# Altium schematic sheet THS7002CPWP_Schematic.SchDoc
size A; SheetNumber: 12; SheetTotal: 15
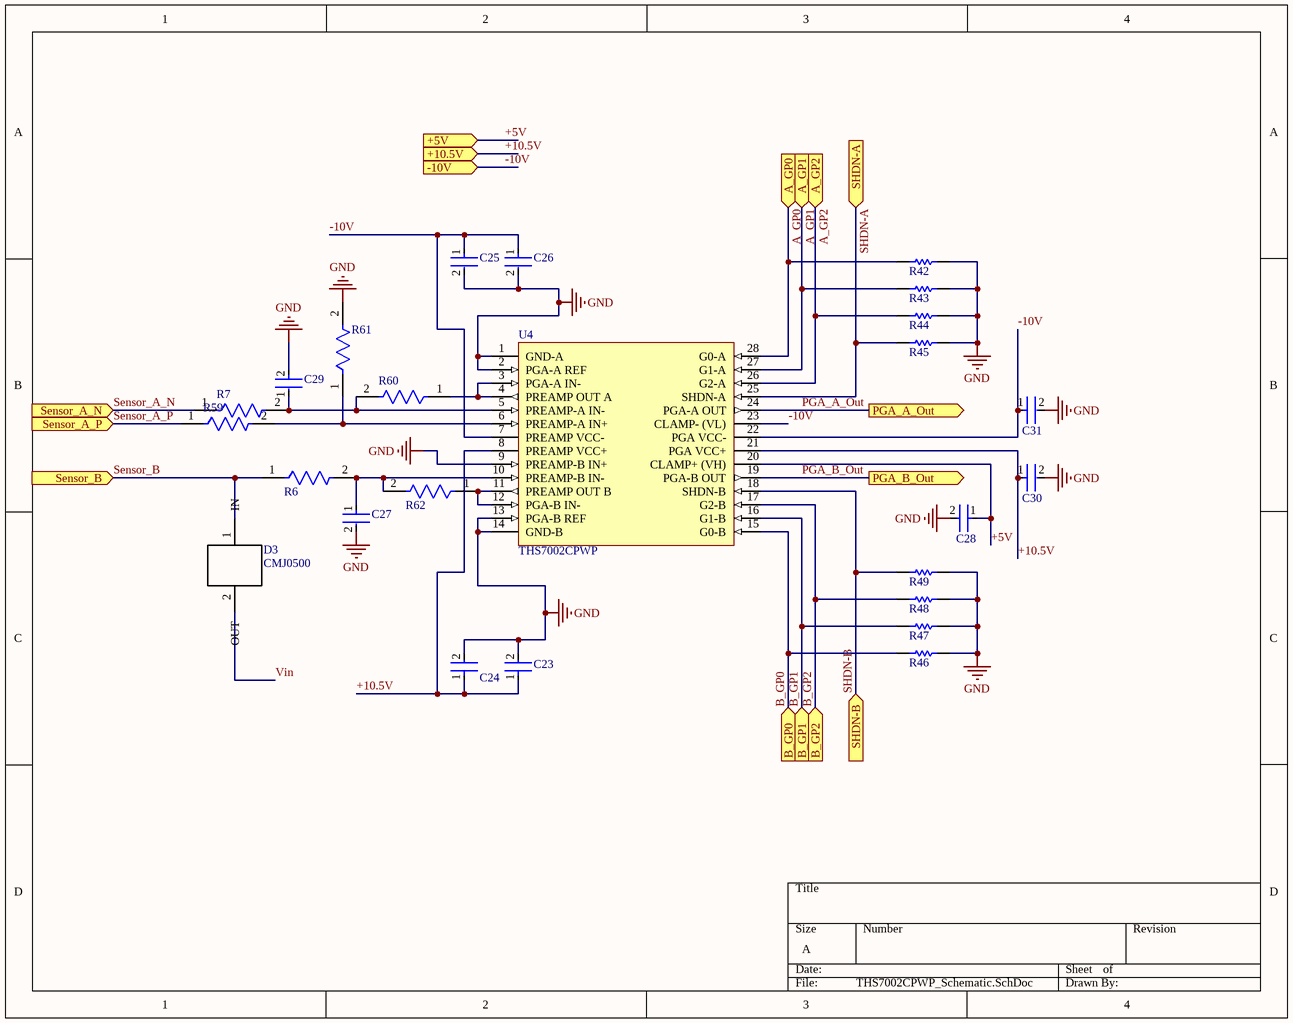
[diagram p0: THS7002CPWP_Schematic.SchDoc]

## Parts
C23  (no value)  [FP-C2012-060-0_2-IPC_A]
C24  CC0603KRX7R7BB104  [FP-CC0603-DA-MFG]  (value not drawn)
C25  CC0603KRX7R7BB104  [FP-CC0603-DA-MFG]  (value not drawn)
C26  (no value)  [FP-C2012-060-0_2-IPC_A]
C27  GRM2195C1H622JA01D  [FP-GRM219-0_1-IPC_C]  (value not drawn)
C28  (no value)  [FP-C2012-060-0_2-IPC_A]
C29  GRM2165C1H302JA01D  [FP-GRM216-0_1-IPC_A]  (value not drawn)
C30  CC0603KRX7R7BB104  [FP-CC0603-DA-MFG]  (value not drawn)
C31  CC0603KRX7R7BB104  [FP-CC0603-DA-MFG]  (value not drawn)
D3  CMJ0500  [CMJ2000_Footprint]
R6  CRCW0603499RFKEA  [FP-CRCW0603-e3-MFG]  (value not drawn)
R7  CRCW0603499RFKEA  [FP-CRCW0603-e3-MFG]  (value not drawn)
R42  RC0603FR-073K3L  [RESC1608X55X25ML10T15]  (value not drawn)
R43  RC0603FR-073K3L  [RESC1608X55X25ML10T15]  (value not drawn)
R44  RC0603FR-073K3L  [RESC1608X55X25ML10T15]  (value not drawn)
R45  RC0603FR-073K3L  [RESC1608X55X25ML10T15]  (value not drawn)
R46  RC0603FR-073K3L  [RESC1608X55X25ML10T15]  (value not drawn)
R47  RC0603FR-073K3L  [RESC1608X55X25ML10T15]  (value not drawn)
R48  RC0603FR-073K3L  [RESC1608X55X25ML10T15]  (value not drawn)
R49  RC0603FR-073K3L  [RESC1608X55X25ML10T15]  (value not drawn)
R59  CRCW0603499RFKEA  [FP-CRCW0603-e3-MFG]  (value not drawn)
R60  CRCW0603499RFKEA  [FP-CRCW0603-e3-MFG]  (value not drawn)
R61  CRCW0603499RFKEA  [FP-CRCW0603-e3-MFG]  (value not drawn)
R62  CRCW0603499RFKEA  [FP-CRCW0603-e3-MFG]  (value not drawn)
U4  THS7002CPWP  [THS7002CPWP]

## Ports
+5V (in), +10.5V (in), -10V (in), A_GP0 (in), A_GP1 (in), A_GP2 (in), B_GP0 (in), B_GP1 (in), B_GP2 (in), PGA_A_Out (out), PGA_B_Out (out), Sensor_A_N (in), Sensor_A_P (in), Sensor_B (in), SHDN-A (in), SHDN-B (in)

## Nets
GND: C23.2 C24.2 C25.2 C26.2 C27.2 C28.2 C29.2 C30.2 C31.2 R42.1 R43.1 R44.1 R45.1 R46.1 R47.1 R48.1 R49.1 R61.2 U4.1(GND-A) U4.2(PGA-A_REF) U4.9(PREAMP-B_IN+) U4.13(PGA-B_REF) U4.14(GND-B)
+5V: C28.1 U4.20(CLAMP+_(VH)) ; port +5V
+10.5V: C23.1 C24.1 C30.1 U4.8(PREAMP_VCC+) U4.21(PGA_VCC+) ; port +10.5V
-10V: C25.1 C26.1 C31.1 U4.7(PREAMP_VCC-) U4.22(PGA_VCC-) U4.23(CLAMP-_(VL)) ; port -10V
A_GP0: R42.2 U4.28(G0-A) ; port A_GP0
A_GP1: R43.2 U4.27(G1-A) ; port A_GP1
A_GP2: R44.2 U4.26(G2-A) ; port A_GP2
B_GP0: R46.2 U4.15(G0-B) ; port B_GP0
B_GP1: R47.2 U4.16(G1-B) ; port B_GP1
B_GP2: R48.2 U4.17(G2-B) ; port B_GP2
PGA_A_Out: U4.24(PGA-A_OUT) ; port PGA_A_Out
PGA_B_Out: U4.19(PGA-B_OUT) ; port PGA_B_Out
Sensor_A_N: R7.1 ; port Sensor_A_N
Sensor_A_P: R59.1 ; port Sensor_A_P
Sensor_B: R6.1 ; port Sensor_B
SHDN-A: R45.2 U4.25(SHDN-A) ; port SHDN-A
SHDN-B: R49.2 U4.18(SHDN-B) ; port SHDN-B
NetC27_1: C27.1 R6.2 R62.2 U4.10(PREAMP-B_IN-)
NetC29_1: C29.1 R7.2 R60.2 U4.5(PREAMP-A_IN-)
NetR59_2: R59.2 R61.1 U4.6(PREAMP-A_IN+)
NetR60_1: R60.1 U4.3(PGA-A_IN-) U4.4(PREAMP_OUT_A)
NetR62_1: R62.1 U4.11(PREAMP_OUT_B) U4.12(PGA-B_IN-)

Not connected (* = marked no-connect by the designer): D3 1(IN) 2(OUT)

## Library data of the parts
C23 C26 C28 = CMP-08246-004641-1: Multilayer Ceramic Capacitors 6.8μF ±10% 10V JB SMD 0805; Capacitance: 6.8uF; RoHS Compliant: Yes; Case Code (Metric): 5032; Case/Package: 0805; Voltage Rating: 10V; Width: 0.049inch; Min Operating Temperature: -25°C; Mount: Surface Mount; Voltage Rating (DC): 10V; Dielectric Material: Ceramic; Case Code (Imperial): 2012; Package Quantity: 4000; Lead Free: Lead Free; Packaging: Tape and Reel; Length: 0.079inch; Tolerance: 10%; Thickness: 0.028inch; Max Operating Temperature: 85°C; Series: C
C24 C25 C30 C31 = CMP-2000-05002-2: CAP CER 0.1UF 16V X7R 0603; Manufacturer: YAGEO; Tolerance: 0.1; Value: 100 nF; Temperature Coefficient: 15%; Material: Ceramic; Voltage Rating: 16 V; Package: CC0603-DA; ComponentLink2Description: Datasheet; Octopart: https://octopart.com/cc0603krx7r7bb104-yageo-192941; Temperature Range High: +125°C; Digikey Description: CAP CER 0.1UF 16V X7R 0603; Voltage: 16 V; Device Class L2: Capacitors; Height: 0.9mm; Temperature: -55°C to +125°C; Manufacturer Part Number: CC0603KRX7R7BB104; Device Class L1: Passive Components; Device Class L3: Ceramic Capacitors; ComponentLink2URL: http://www.yageo.com/documents/recent/UPY-GPHC_X7R_6.3V-to-50V_18.pdf; Footprint Url: http://www.yageo.com/exep/pages/download/literatures/UPY-C_GEN_24.pdf; RoHS: TRUE; Temperature Range Low: -55°C; Temperature Characteristic: X7R; Lead Free: Yes; Capacitance: 100 nF; Category: Cap; Mouser Description: Multilayer Ceramic Capacitor, CC Series, 0.1 - F, - 10%, X7R, 16 V, 0603 [1608 Metric]; Automotive: No
C27 = CMP-2007-00144-2: Chip Multilayer Ceramic Capacitors for General Purpose, 0805, 6200pF, C0G, 30ppm/°C, 5%, 50V; Capacitance: 6.2nF; Termination: SMD/SMT; Tolerance: 5%; Radiation Hardening: No; Voltage: 50V; Lead Free: Lead Free; Case Code (Imperial): 0805; Width: 0.049inch; Thickness: 0.037inch; Depth: 1.25mm; Mount: Surface Mount; Length: 2mm; Packaging: Tape and Reel; Voltage Rating (DC): 50V; Case/Package: 0805; Height: 0.85mm; Package Quantity: 1; Dielectric: C0G; Min Operating Temperature: -55°C; Max Operating Temperature: 125°C; Voltage Rating: 50V; Case Code (Metric): 2012
C29 = CMP-06035-063048-1: Chip Multilayer Ceramic Capacitors for General Purpose, 0805, 3000pF, C0G, 30ppm/°C, 5%, 50V; Capacitance: 3nF; Package Quantity: 1; Mount: Surface Mount; Voltage Rating: 50V; Length: 2mm; Case Code (Imperial): 0805; Depth: 1.25mm; Termination: SMD/SMT; Case Code (Metric): 2012; RoHS Compliant: Yes; Packaging: Tape and Reel; Case/Package: 0805; Width: 1.25mm; Height: 0.6mm; Max Operating Temperature: 125°C; Min Operating Temperature: -55°C; Voltage: 50V; Series: GRM; Voltage Rating (DC): 50V; Thickness: 0.028inch; Lead Free: Lead Free; Dielectric: C0G; Tolerance: 5%
D3 = CMJ2000/0130: CMJ0500: DIODE CUR REG 100V 0.5mA 500MW; ComponentLink1Description: New link; ComponentLink1URL: *
R6 R7 R59-R62 = CMP-2000-03390-2: RES Thick Film, 499Ω, 1%, 0.1W, 100ppm/°C, 0603; Voltage Rating (DC): 75V; Power Rating: 100mW; Resistance: 499R; Case/Package: 0603; Package Quantity: 5000; Military Standard: Not; Length: 1.55mm; Width: 0.85mm; Number of Terminations: 2; Lead Free: Lead Free; Height: 0.45mm; Weight: 7.1E-05oz; Composition: Thick Film; Radiation Hardening: No; Max Operating Temperature: 155°C; Tolerance: 1%; Working Voltage: 75V; Temperature Coefficient: 100ppm/°C; Packaging: Tape and Reel; Contact Plating: Tin; Termination: SMD/SMT; Depth: 0.85mm; Case Code (Metric): 1608; Min Operating Temperature: -55°C; Mount: Surface Mount; Case Code (Imperial): 0603; Voltage Rating: 75V
R42-R49 = CMP-1012-00567-2: Chip Resistor, 3.3 KOhm, +/- 1%, 0.1 W, -55 to 155 degC, 0603 (1608 Metric), RoHS, Tape and Reel; Manufacturer: Yageo; Temperature Coefficient: 100ppm/degreesC; Voltage Rating: 50V; Max Power Dissipation: 100mW; Resistance: 3.3KOhm; Case Code (Metric): 1608; Case/Package: 0603; Composition: ThickFilm; RoHSCompliant: true; Datasheet Version: Rev. 5, 10/2016; REACH SVHC: NoSVHC; Width: 0.8mm; Package Quantity: 1; Depth: 0.8mm; Voltage Rating (DC): 50V; Termination: SMD/SMT; Length: 1.6mm; Lead Free: LeadFree; Package Description: 2-Pin Surface Mount Device, Body 1.6 x 0.8 mm; Max Operating Temperature: 155degC; Tolerance: 1%; Height: 0.45mm; Number of Pins: 2; Military Standard: Not; Power Rating: 100mW; Datasheet URL: http://www.yageo.com/NewPortal/yageodocoutput?fileName=/pdf/R-Chip/PYu-RC_Group_51_RoHS_L_5.pdf; Case Code (Imperial): 0603; Manufacturer URL: http://www.yageo.com/; Packaging: TapeandReel; Min Operating Temperature: -55degC; Package Reference: 0603; Number of Terminations: 2
U4 = CMP-0988-00132-2: 70-MHz High-Speed Programmable-Gain Amplifier, Dual, 0 to 70 degC, 28-pin SOP (PWP28), Green (RoHS & no Sb/Br); Manufacturer: Texas Instruments; Disable: TRUE; BW @ Acl(MHz): 100; Vs(Min)(V): 9; Vs(Max)(V): 32; Number of Channels: 2; Vio(Max)(mV): 7; Iib(Max)(nA): 6000; SubFamily: Variable Gain Amplifier; Vn at Flatband(Typ)(nV/rtHz): 1.7; Slew Rate(Typ)(V/us): 85; ComponentLink1Description: Manufacturer URL; Code_JEDEC: MO-153; PackageVersion: 4073225-6/I, 05/2011; PackageReference: PWP0028E; Eco-Plan: Green (RoHS & no Sb/Br); ComponentLink2URL: http://www.ti.com/general/docs/lit/getliterature.tsp?genericPartNumber=THS7002&fileType=pdf; PackageDescription: 28-Pin Plastic Small Outline, Body 4.4 x 9.7 mm, Pitch 0.65 mm; DatasheetVersion: SLOS214C; ComponentLink3URL: http://www.ti.com/litv/pdf/mpds373; ComponentLink3Description: Package Specification; ComponentLink1URL: http://www.ti.com/; ComponentLink2Description: Datasheet; Mounting Technology: Surface Mount; PartNumber: THS7002CPWP